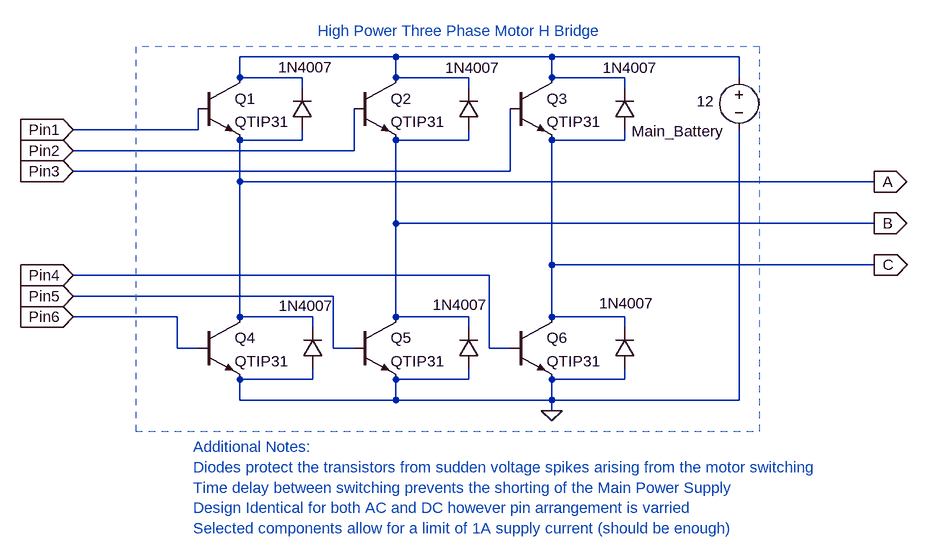
[diagram p0: schematic H_Bridge_Driver.asc]
H_Bridge_Driver.asc, the LTspice schematic file:
Version 4
SHEET 1 880 680
WIRE -80 -288 -320 -288
WIRE 160 -288 -80 -288
WIRE 448 -288 160 -288
WIRE -320 -256 -320 -288
WIRE -224 -256 -320 -256
WIRE -80 -256 -80 -288
WIRE 32 -256 -80 -256
WIRE 160 -256 160 -288
WIRE 272 -256 160 -256
WIRE 448 -256 448 -288
WIRE -224 -240 -224 -256
WIRE 32 -240 32 -256
WIRE 272 -240 272 -256
WIRE -384 -176 -384 -208
WIRE -384 -176 -576 -176
WIRE -224 -160 -224 -176
WIRE -224 -160 -320 -160
WIRE 32 -160 32 -176
WIRE 32 -160 -80 -160
WIRE 272 -160 272 -176
WIRE 272 -160 160 -160
WIRE -144 -144 -144 -208
WIRE -144 -144 -576 -144
WIRE 96 -112 96 -208
WIRE 96 -112 -576 -112
WIRE -320 -96 -320 -160
WIRE 656 -96 -320 -96
WIRE -80 -32 -80 -160
WIRE 656 -32 -80 -32
WIRE 160 32 160 -160
WIRE 656 32 160 32
WIRE 64 48 -576 48
WIRE -176 80 -576 80
WIRE -416 112 -576 112
WIRE -320 112 -320 -96
WIRE -208 112 -320 112
WIRE -80 112 -80 -32
WIRE 32 112 -80 112
WIRE 160 112 160 32
WIRE 272 112 160 112
WIRE -208 128 -208 112
WIRE 32 128 32 112
WIRE 272 128 272 112
WIRE -416 160 -416 112
WIRE -384 160 -416 160
WIRE -176 160 -176 80
WIRE -144 160 -176 160
WIRE 64 160 64 48
WIRE 96 160 64 160
WIRE -208 208 -208 192
WIRE -208 208 -320 208
WIRE 32 208 32 192
WIRE 32 208 -80 208
WIRE 272 208 272 192
WIRE 272 208 160 208
WIRE -320 240 -320 208
WIRE -80 240 -80 208
WIRE -80 240 -320 240
WIRE 160 240 160 208
WIRE 160 240 -80 240
WIRE 448 240 448 -176
WIRE 448 240 160 240
WIRE 160 256 160 240
FLAG 160 256 0
FLAG -576 -176 Pin1
IOPIN -576 -176 In
FLAG -576 -144 Pin2
IOPIN -576 -144 In
FLAG -576 -112 Pin3
IOPIN -576 -112 In
FLAG -576 48 Pin4
IOPIN -576 48 In
FLAG -576 80 Pin5
IOPIN -576 80 In
FLAG -576 112 Pin6
IOPIN -576 112 In
FLAG 656 -96 A
IOPIN 656 -96 Out
FLAG 656 -32 B
IOPIN 656 -32 Out
FLAG 656 32 C
IOPIN 656 32 Out
SYMBOL voltage 448 -272 M0
WINDOW 123 0 0 Left 2
WINDOW 39 0 0 Left 2
WINDOW 0 165 98 Right 2
WINDOW 3 65 52 Right 2
SYMATTR InstName Main_Battery
SYMATTR Value 12
SYMBOL diode -240 -176 M180
WINDOW 0 24 64 Invisible 2
WINDOW 3 -21 96 Left 2
SYMATTR InstName D1
SYMATTR Value 1N4007
SYMBOL diode 16 -176 M180
WINDOW 0 24 64 Invisible 2
WINDOW 3 -20 95 Left 2
SYMATTR InstName D2
SYMATTR Value 1N4007
SYMBOL diode 256 -176 M180
WINDOW 0 24 64 Invisible 2
WINDOW 3 -18 95 Left 2
SYMATTR InstName D3
SYMATTR Value 1N4007
SYMBOL diode 256 192 M180
WINDOW 0 24 64 Invisible 2
WINDOW 3 -23 101 Left 2
SYMATTR InstName D4
SYMATTR Value 1N4007
SYMBOL diode 16 192 M180
WINDOW 0 24 64 Invisible 2
WINDOW 3 -39 99 Left 2
SYMATTR InstName D5
SYMATTR Value 1N4007
SYMBOL diode -224 192 M180
WINDOW 0 24 64 Invisible 2
WINDOW 3 -36 97 Left 2
SYMATTR InstName D6
SYMATTR Value 1N4007
SYMBOL npn -384 -256 R0
SYMATTR InstName Q1
SYMATTR Value QTIP31
SYMBOL npn -144 -256 R0
SYMATTR InstName Q2
SYMATTR Value QTIP31
SYMBOL npn 96 -256 R0
SYMATTR InstName Q3
SYMATTR Value QTIP31
SYMBOL npn -384 112 R0
SYMATTR InstName Q4
SYMATTR Value QTIP31
SYMBOL npn -144 112 R0
SYMATTR InstName Q5
SYMATTR Value QTIP31
SYMBOL npn 96 112 R0
SYMATTR InstName Q6
SYMATTR Value QTIP31
TEXT -200 -328 Left 2 ;High Power Three Phase Motor H Bridge
TEXT -392 312 Left 2 ;Additional Notes:\nDiodes protect the transistors from sudden voltage spikes arising from the motor switching\nTime delay between switching prevents the shorting of the Main Power Supply\nDesign Identical for both AC and DC however pin arrangement is varried\nSelected components allow for a limit of 1A supply current (should be enough)
RECTANGLE Normal -480 288 480 -304 2

The netlist it stands for:
* H_Bridge_Driver.asc
V§Main_Battery N001 0 12
D1 A N001 1N4007
D2 B N001 1N4007
D3 C N001 1N4007
D4 0 C 1N4007
D5 0 B 1N4007
D6 0 A 1N4007
Q1 N001 Pin1 A 0 QTIP31
Q2 N001 Pin2 B 0 QTIP31
Q3 N001 Pin3 C 0 QTIP31
Q4 A Pin6 0 0 QTIP31
Q5 B Pin5 0 0 QTIP31
Q6 C Pin4 0 0 QTIP31
.model D D
.lib standard.dio
.model NPN NPN
.model PNP PNP
.lib standard.bjt
* High Power Three Phase Motor H Bridge
* Additional Notes:
* Diodes protect the transistors from sudden voltage spikes arising from the motor switching
* Time delay between switching prevents the shorting of the Main Power Supply
* Design Identical for both AC and DC however pin arrangement is varried
* Selected components allow for a limit of 1A supply current (should be enough)
.backanno
.end